# Altium schematic sheet AIn_Isolator.SchDoc
size A4; DocumentNumber: 6; SheetNumber: 6; SheetTotal: 16
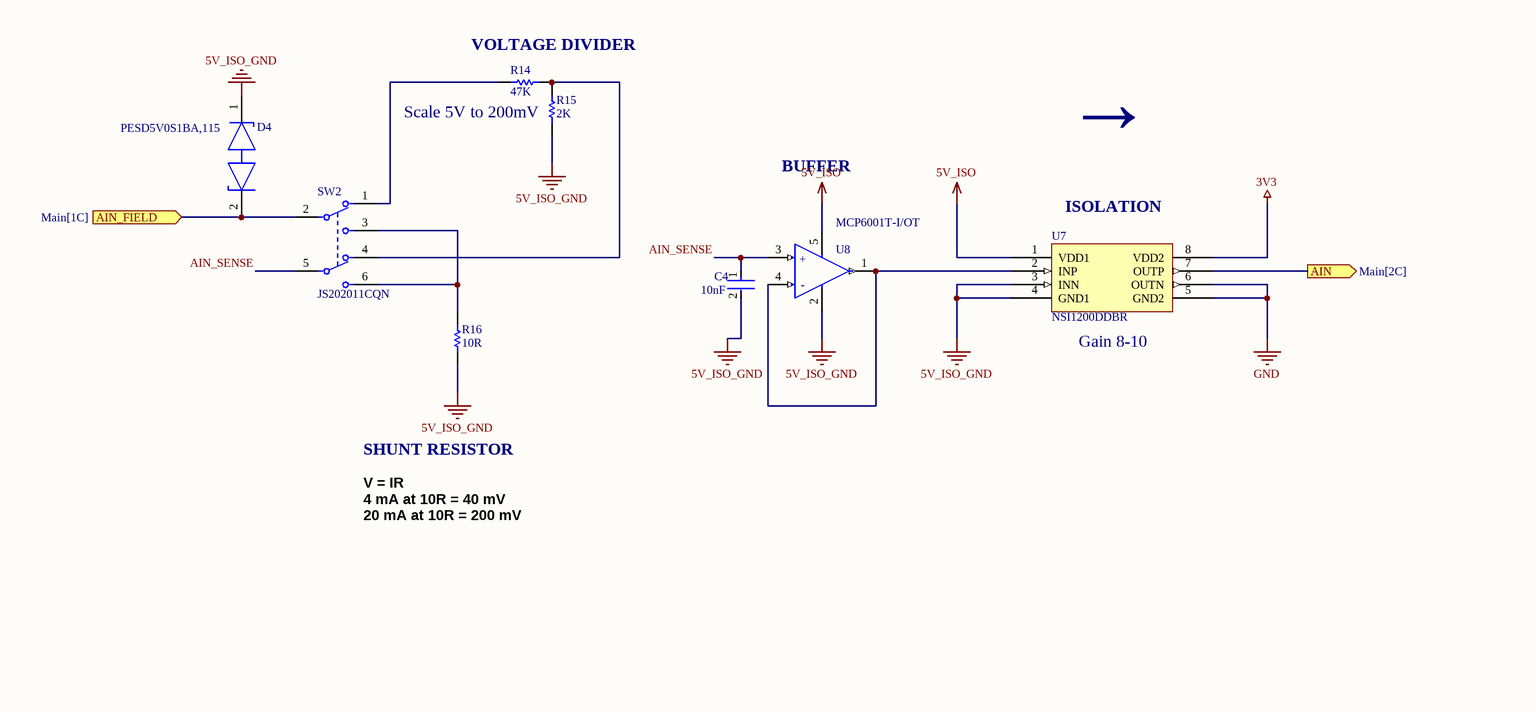
[diagram p0: AIn_Isolator.SchDoc, left]
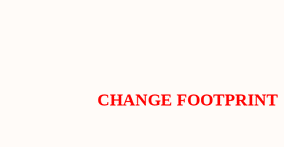
[diagram p1: AIn_Isolator.SchDoc, right]

## Parts
C4  10nF  [FP-CC0603-DA-MFG]
D4  PESD5V0S1BA,115  [FP-SOD323-CA-MFG]
R14  47K  [RESC1608X55X30NL15T15]
R15  2K  [RESC1608X55X30ML15T15]
R16  10R  [RESC3216X70X50LL20T25]
SW2  JS202011CQN  [FP-JS202011CQN-MFG - duplicate]
U7  NSI1200DDBR  [NSI1200DDBR]
U8  MCP6001T-I/OT  [FP-C04-091-OT-IPC_A]

## Ports
AIN (out, see Main[2C]), AIN_FIELD (in, see Main[1C])

## Nets
3V3: U7.8(VDD2)
5V_ISO: U7.1(VDD1) U8.5(VDD)
5V_ISO_GND: C4.2 D4.1(K1) R15.1 R16.2 U7.3(INN) U7.4(GND1) U8.2(VSS)
GND: U7.5(GND2) U7.6(OUTN)
AIN: U7.7(OUTP) ; port AIN
AIN_FIELD: D4.2(K2) SW2.2 ; port AIN_FIELD
AIN_SENSE: C4.1 SW2.5 U8.3(VIN+)
NetR14_1: R14.1 SW2.1
NetR14_2: R14.2 R15.2 SW2.4
NetR16_1: R16.1 SW2.3 SW2.6
NetU7_2: U7.2(INP) U8.1(VOUT) U8.4(VIN-)

## Notes on the sheet
- VOLTAGE DIVIDER
- (near R15) Scale 5V to 200mV
- →
- BUFFER
- (near U7) ISOLATION
- (near U7) Gain 8-10
- SHUNT RESISTOR
- V = IR
  4 mA at 10R = 40 mV
  20 mA at 10R = 200 mV
- CHANGE FOOTPRINT
- (in symbol CMP-0187-00462-3) +; -

## Library data of the parts
C4 = CMP-2100-03600-2: CAP CER 10000PF 50V X7R 0603; Manufacturer Part Number: CC0603KRX7R9BB103; Manufacturer: YAGEO; Tolerance: 0.1; Material: Ceramic; Temperature Coefficient: 15%; Mouser Description: Multilayer Ceramic Capacitor, CC Series, 0.01 - F, - 10%, X7R, 50 V, 0603 [1608 Metric]; Digikey Description: CAP CER 10000PF 50V X7R 0603; Height: 0.9mm; Category: Cap; Temperature Characteristic: X7R; Footprint Url: http://www.yageo.com/exep/pages/download/literatures/UPY-C_GEN_24.pdf; Lead Free: Yes; Voltage Rating: 50 V; Temperature: -55°C to +125°C; Device Class L3: Ceramic Capacitors; ComponentLink2Description: Datasheet; Voltage: 50 V; Package: CC0603-DA; Octopart: https://octopart.com/cc0603krx7r9bb103-yageo-192938; Automotive: No; Temperature Range High: +125°C; Temperature Range Low: -55°C; Value: 10 nF; RoHS: TRUE; Device Class L1: Passive Components; ComponentLink2URL: http://www.yageo.com/documents/recent/UPY-GPHC_X7R_6.3V-to-50V_18.pdf; Device Class L2: Capacitors; Capacitance: 10 nF
D4 = CMP-14432-000001-1: TVS DIODE 5V 14V SOD323
R14 = CMP-2000-00523-2: Chip Resistor, 47 KOhm, +/- 1%, 0.1 W, -55 to 155 degC, 0603 (1608 Metric), RoHS, Tape and Reel; Case\Package: 0603; Forward Current: 20 mA; Power Rating: 90 mW; Illumination Colour: Red; Nominal Vf: 2.1 V; Viewing Angle: 160 degrees; Luminous Intensity: 63 mcd; Lens Style: Clear; Nominal Wavelength: 639 nm; Case Code (Imperial): 0603; Case Code (Metric): 1608; Packaging: Tape and Reel; Radiation Hardening: No; Colour: Red; PackageDescription: 2-Pin Surface Mount Device, Body 1.6 x 0.85 mm; ComponentLink1Description: Manufacturer URL; Width: 0.8 mm; DatasheetVersion: Apr-15; ComponentLink2URL: http://industrial.panasonic.com/cdbs/www-data/pdf/RDA0000/AOA0000C86.pdf; Min Operating Temperature: -40 degC; Height: 0.6 mm; Package Quantity: 3000; ComponentLink2Description: Datasheet; REACH SVHC: No SVHC; ComponentLink1URL: http://www.panasonic.com/; Mount: Surface Mount; RoHSCompliant: true; Max Operating Temperature: 100 degC; PackageReference: 0603; Length: 1.6 mm; Forward Voltage: 2.1 V; Pins: 2
R15 = CMP-2000-00317-1: Part Number: ERJ-3EKF2001V; Manufacturer: Panasonic
R16 = CMP-2003-04407-1: Manufacturer: Panasonic; Part Number: ERA8AEB103V
SW2 = CMP-10038-000022-1_1: SWITCH SLIDE DPDT 300MA 6V; Contact Resistance: 70mR; Actuator Type: Standard; Actuator Color: Black; Actuator Material: Nylon; Actuator Length: 2mm; Contact Current Rating: 100mA; Electrical Life: 5000Cycles; Illumination Type: Non-Illuminated; Switch Function: On-On; Depth: 3.6mm; Lead Free: Lead Free; Current Rating: 300mA; Throw Configuration: DPDT; REACH SVHC: No SVHC; Flammability Rating: UL94 V-0; Contact Plating: Silver; Max Current Rating: 300mA; Packaging: Bulk; Radiation Hardening: No; Switch Travel: 2mm; Package Quantity: 1; Voltage Rating (DC): 6V; Housing Material: Nylon; Contact Material: Copper Alloy; Min Operating Temperature: -40°C; Max Operating Temperature: 85°C; Termination: PC Pins; Mount: Through Hole; Length: 9mm; Max Voltage Rating (DC): 6V; RoHS Compliant: Yes; Series: JS; Orientation: Vertical
U7 = NSI1200DDBR: High Reliability Reinforced Isolated Amplifier; Manufacturer: Novosense; Manufacturer Part Number: NSI1200DDBR; ComponentLink1Description: Datasheet; ComponentLink1URL: https://file.elecfans.com/web2/M00/63/D8/poYBAGMEo2GAVfdLABzacvfTaPY750.pdf
U8 = CMP-0187-00462-3: IC OPAMP GP 1 CIRCUIT SOT23-5; Number of Amplifiers: 1; Voltage: 6V; Power Supply Rejection Ratio (PSRR): 86dB; Common Mode Rejection Ratio: 60dB; Unity Gain Bandwidth Product: 1MHz; Slew Rate: 0.6V/µs; Output Current per Channel: 23mA; Nominal Supply Current: 100uA; Input Offset Voltage (Vos): 4.5mV; Input Bias Current: 1pA; Operating Supply Voltage: 5.5V; Min Supply Voltage: 1.8V; Voltage Gain: 112dB; Length: 3.1mm; REACH SVHC: No SVHC; Number of Pins: 5; Package Quantity: 1; Radiation Hardening: No; Mount: Surface Mount; Number of Circuits: 1; Number of Elements: 1; Output Current: 23mA; Packaging: Tape and Reel; Height: 1.3mm; Lead Free: Lead Free; Min Operating Temperature: -40°C; Bandwidth: 1MHz; Contact Plating: Tin; Max Supply Voltage: 6V; Max Operating Temperature: 85°C; Width: 1.8mm; Case/Package: SOT-23; Operating Supply Current: 100uA; Number of Channels: 1; Gain Bandwidth Product: 1MHz